# Altium schematic sheet ISC.SchDoc
size A2
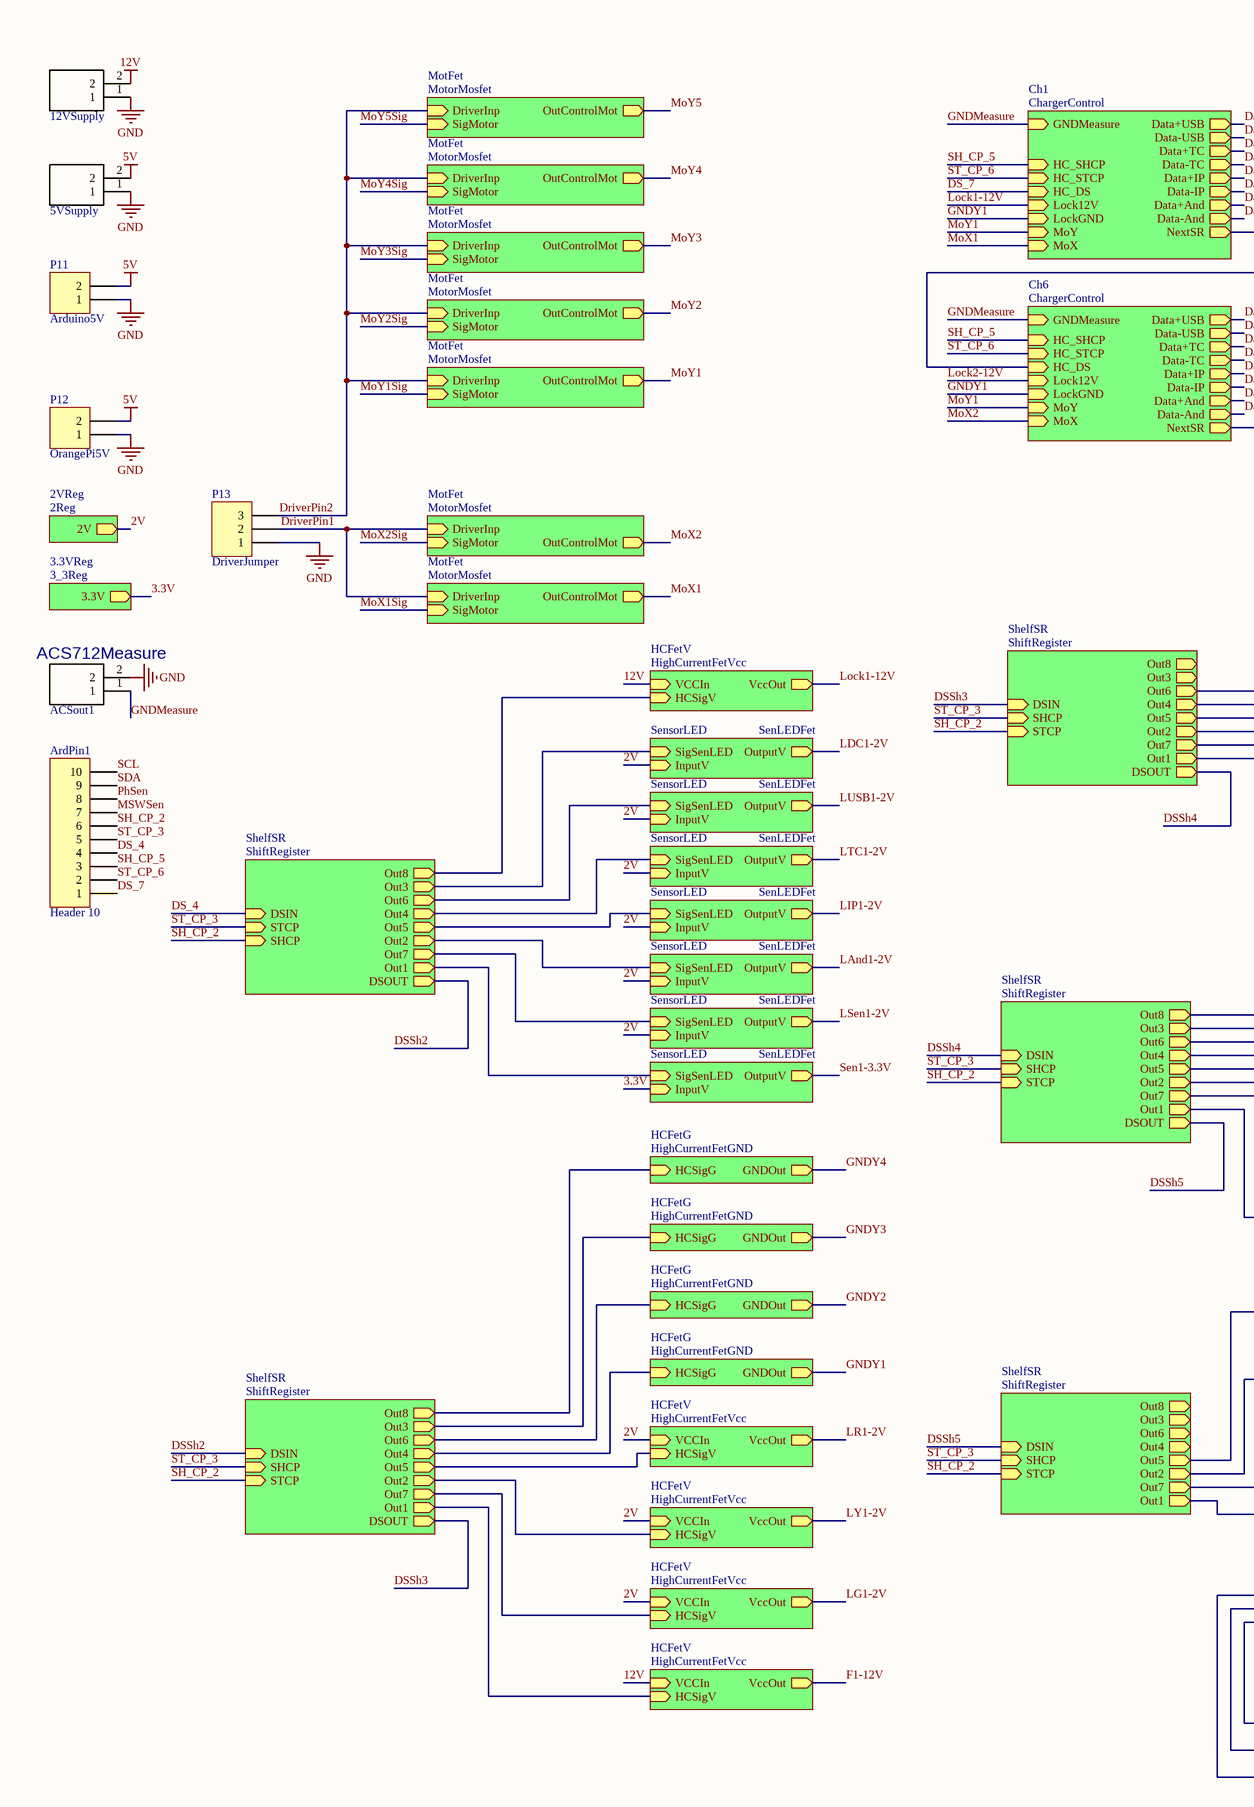
[diagram p0: ISC.SchDoc, left]
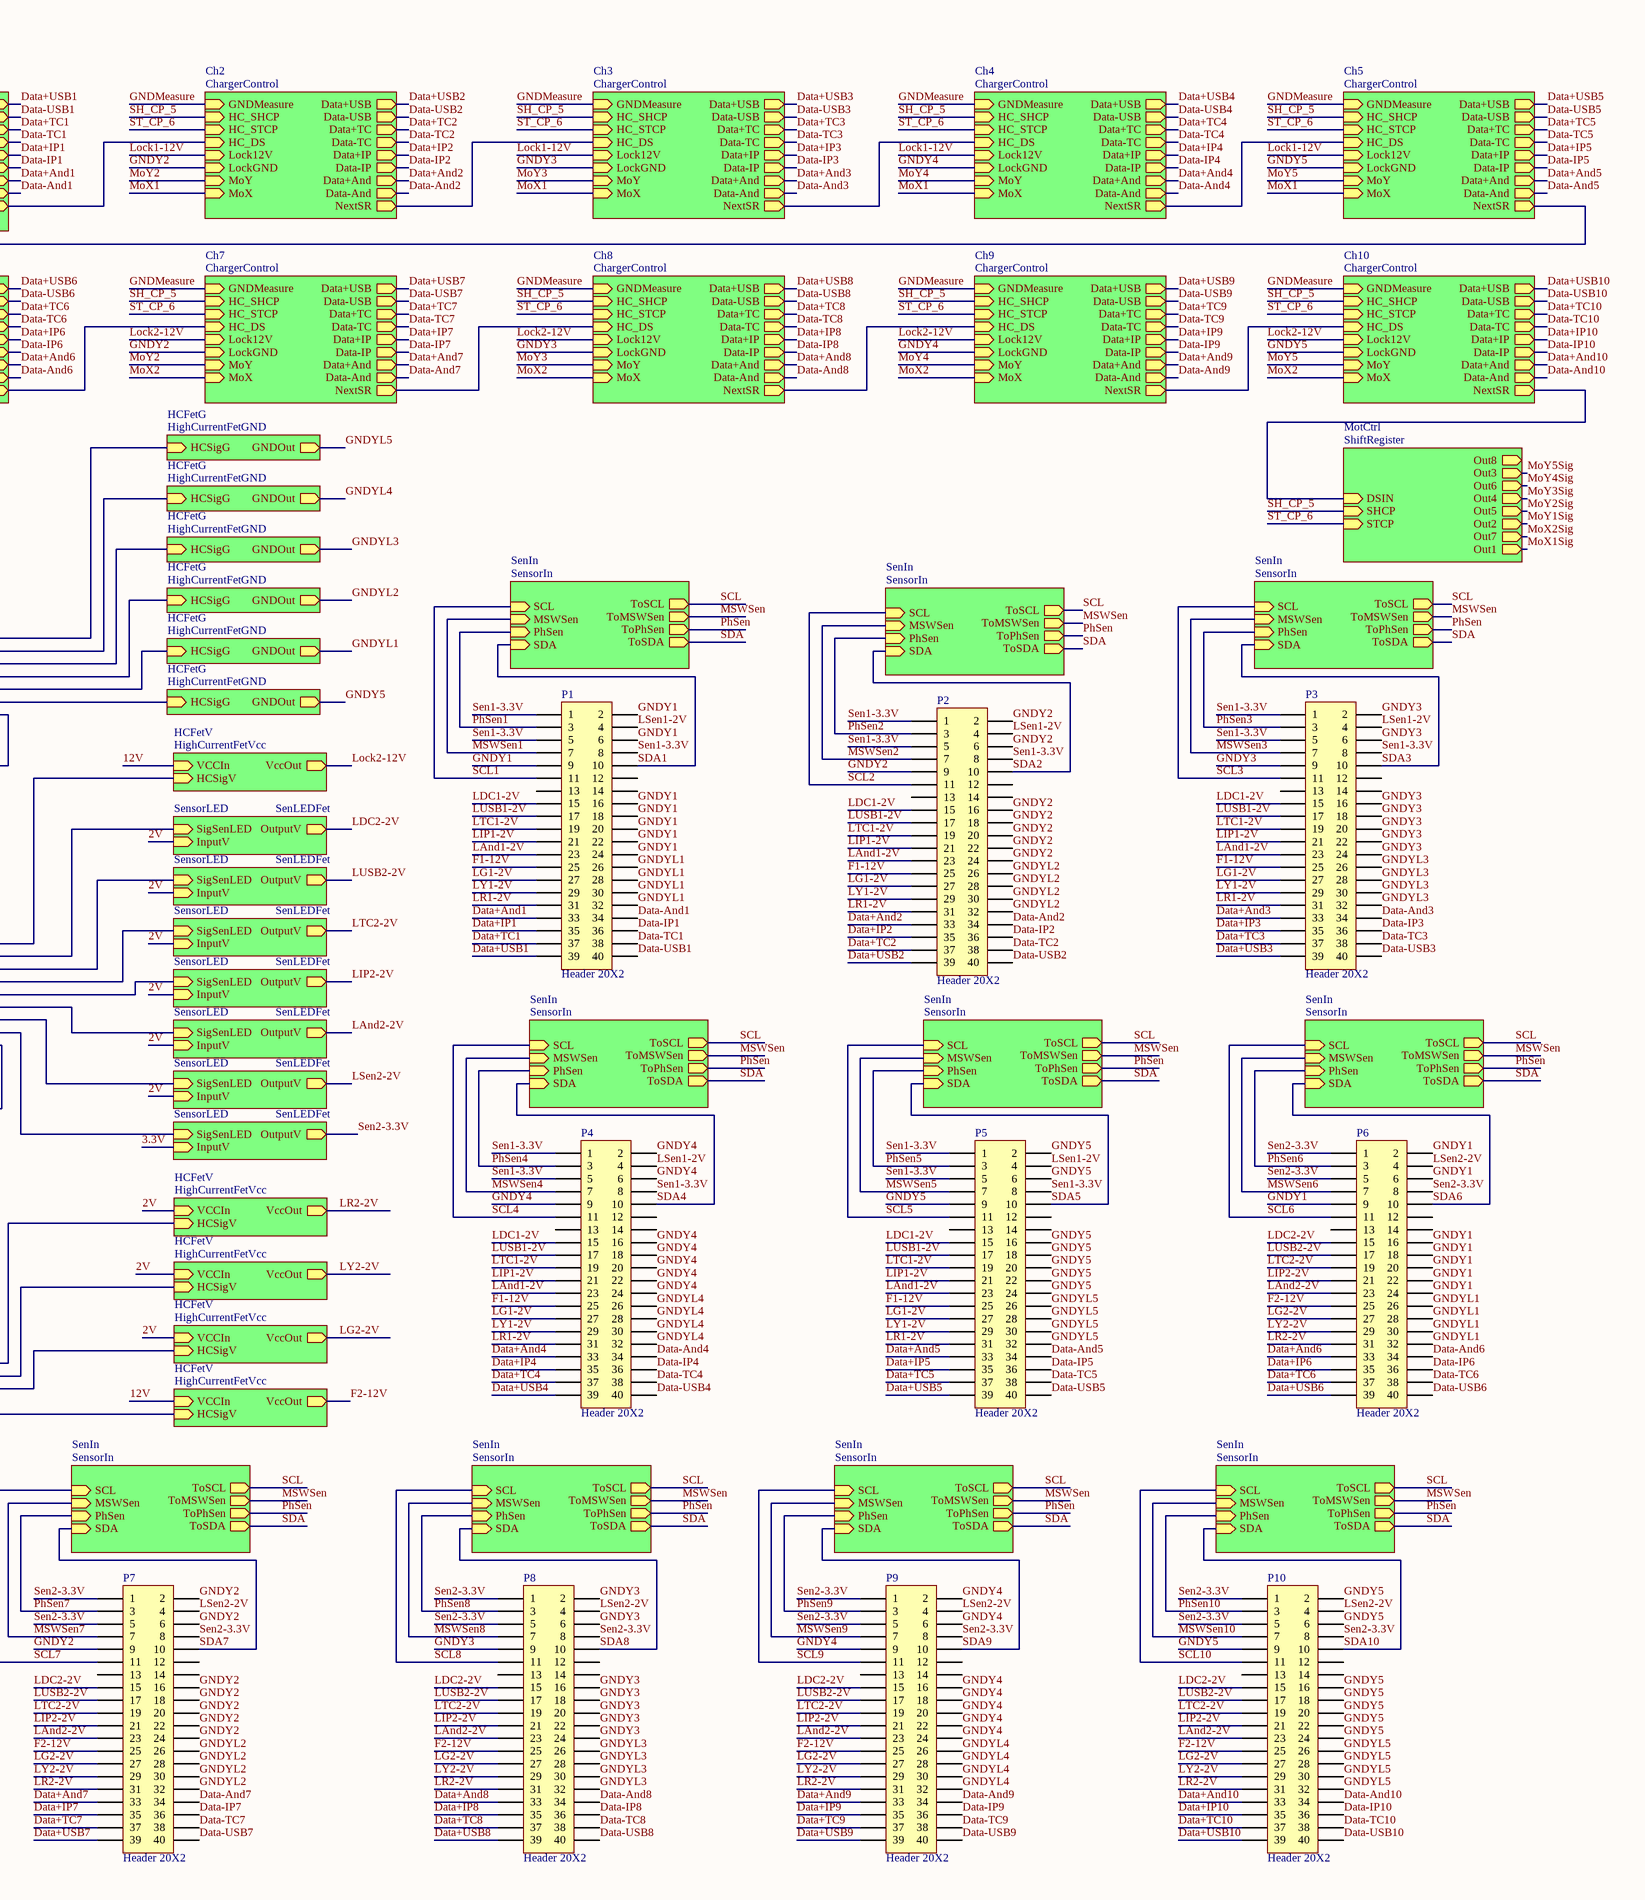
[diagram p1: ISC.SchDoc, right]

## Parts
5VSupply  6-1123723-2  [*TE_6-1123723-2]  (value not drawn)
12VSupply  6-1123723-2  [*TE_6-1123723-2]  (value not drawn)
ACSout1  ACS712Measure  [*TE_6-1123723-2]
ArdPin1  Header 10  [HDR1X10]
P1  Header 20X2  [HDR2X20]
P2  Header 20X2  [HDR2X20]
P3  Header 20X2  [HDR2X20]
P4  Header 20X2  [HDR2X20]
P5  Header 20X2  [HDR2X20]
P6  Header 20X2  [HDR2X20]
P7  Header 20X2  [HDR2X20]
P8  Header 20X2  [HDR2X20]
P9  Header 20X2  [HDR2X20]
P10  Header 20X2  [HDR2X20]
P11  Arduino5V  [HDR1X2]
P12  OrangePi5V  [HDR1X2]
P13  DriverJumper  [HDR1X3]

## Sub-sheets
2VReg = 2Reg: 2V (out)
3.3VReg = 3_3Reg: 3.3V (out)
Ch1 = ChargerControl: GNDMeasure (in), HC_SHCP (in), HC_STCP (in), HC_DS (in), Data+USB (out), Data-USB (out), Data-TC (out), Data+TC (out), Data-And (out), Data+IP (out), Data-IP (out), Data+And (out), NextSR (out), Lock12V (in), LockGND (in), MoY (in), MoX (in)
Ch2 = ChargerControl: GNDMeasure (in), MoY (in), MoX (in), HC_SHCP (in), HC_STCP (in), HC_DS (in), Data+USB (out), Data-USB (out), Data-TC (out), Data+TC (out), Data-And (out), Data+IP (out), Data-IP (out), Data+And (out), NextSR (out), Lock12V (in), LockGND (in)
Ch3 = ChargerControl: GNDMeasure (in), MoY (in), MoX (in), HC_SHCP (in), HC_STCP (in), HC_DS (in), Data+USB (out), Data-USB (out), Data-TC (out), Data+TC (out), Data-And (out), Data+IP (out), Data-IP (out), Data+And (out), NextSR (out), Lock12V (in), LockGND (in)
Ch4 = ChargerControl: GNDMeasure (in), MoY (in), MoX (in), HC_SHCP (in), HC_STCP (in), HC_DS (in), Data+USB (out), Data-USB (out), Data-TC (out), Data+TC (out), Data-And (out), Data+IP (out), Data-IP (out), Data+And (out), NextSR (out), Lock12V (in), LockGND (in)
Ch5 = ChargerControl: GNDMeasure (in), MoY (in), MoX (in), HC_SHCP (in), HC_STCP (in), HC_DS (in), Data+USB (out), Data-USB (out), Data-TC (out), Data+TC (out), Data-And (out), Data+IP (out), Data-IP (out), Data+And (out), NextSR (out), Lock12V (in), LockGND (in)
Ch6 = ChargerControl: GNDMeasure (in), Data+USB (out), Data-USB (out), Data-TC (out), Data+TC (out), Data-And (out), Data+IP (out), Data-IP (out), Data+And (out), NextSR (out), HC_SHCP (in), HC_STCP (in), HC_DS (in), Lock12V (in), LockGND (in), MoY (in), MoX (in)
Ch7 = ChargerControl: GNDMeasure (in), MoY (in), MoX (in), HC_SHCP (in), HC_STCP (in), HC_DS (in), Data+USB (out), Data-USB (out), Data-TC (out), Data+TC (out), Data-And (out), Data+IP (out), Data-IP (out), Data+And (out), NextSR (out), Lock12V (in), LockGND (in)
Ch8 = ChargerControl: GNDMeasure (in), MoY (in), MoX (in), HC_SHCP (in), HC_STCP (in), HC_DS (in), Data+USB (out), Data-USB (out), Data-TC (out), Data+TC (out), Data-And (out), Data+IP (out), Data-IP (out), Data+And (out), NextSR (out), Lock12V (in), LockGND (in)
Ch9 = ChargerControl: GNDMeasure (in), MoY (in), MoX (in), HC_SHCP (in), HC_STCP (in), HC_DS (in), Data+USB (out), Data-USB (out), Data-TC (out), Data+TC (out), Data-And (out), Data+IP (out), Data-IP (out), Data+And (out), NextSR (out), Lock12V (in), LockGND (in)
Ch10 = ChargerControl: GNDMeasure (in), MoY (in), MoX (in), HC_SHCP (in), HC_STCP (in), HC_DS (in), Data+USB (out), Data-USB (out), Data-TC (out), Data+TC (out), Data-And (out), Data+IP (out), Data-IP (out), Data+And (out), NextSR (out), Lock12V (in), LockGND (in)
HCFetG = HighCurrentFetGND: HCSigG (in), GNDOut (out)
HCFetG = HighCurrentFetGND: HCSigG (in), GNDOut (out)
HCFetG = HighCurrentFetGND: HCSigG (in), GNDOut (out)
HCFetG = HighCurrentFetGND: HCSigG (in), GNDOut (out)
HCFetG = HighCurrentFetGND: HCSigG (in), GNDOut (out)
HCFetG = HighCurrentFetGND: HCSigG (in), GNDOut (out)
HCFetG = HighCurrentFetGND: HCSigG (in), GNDOut (out)
HCFetG = HighCurrentFetGND: HCSigG (in), GNDOut (out)
HCFetG = HighCurrentFetGND: HCSigG (in), GNDOut (out)
HCFetG = HighCurrentFetGND: HCSigG (in), GNDOut (out)
HCFetV = HighCurrentFetVcc: HCSigV (in), VCCIn (in), VccOut (out)
HCFetV = HighCurrentFetVcc: HCSigV (in), VCCIn (in), VccOut (out)
HCFetV = HighCurrentFetVcc: HCSigV (in), VCCIn (in), VccOut (out)
HCFetV = HighCurrentFetVcc: HCSigV (in), VCCIn (in), VccOut (out)
HCFetV = HighCurrentFetVcc: HCSigV (in), VCCIn (in), VccOut (out)
HCFetV = HighCurrentFetVcc: HCSigV (in), VCCIn (in), VccOut (out)
HCFetV = HighCurrentFetVcc: HCSigV (in), VCCIn (in), VccOut (out)
HCFetV = HighCurrentFetVcc: HCSigV (in), VCCIn (in), VccOut (out)
HCFetV = HighCurrentFetVcc: HCSigV (in), VCCIn (in), VccOut (out)
HCFetV = HighCurrentFetVcc: HCSigV (in), VCCIn (in), VccOut (out)
MotCtrl = ShiftRegister: DSIN (in), SHCP (in), STCP (in), Out8 (out), Out3 (out), Out6 (out), Out4 (out), Out5 (out), Out2 (out), Out7 (out), Out1 (out)
MotFet = MotorMosfet: DriverInp (in), SigMotor (in), OutControlMot (out)
MotFet = MotorMosfet: DriverInp (in), SigMotor (in), OutControlMot (out)
MotFet = MotorMosfet: DriverInp (in), SigMotor (in), OutControlMot (out)
MotFet = MotorMosfet: DriverInp (in), SigMotor (in), OutControlMot (out)
MotFet = MotorMosfet: DriverInp (in), SigMotor (in), OutControlMot (out)
MotFet = MotorMosfet: DriverInp (in), SigMotor (in), OutControlMot (out)
MotFet = MotorMosfet: DriverInp (in), SigMotor (in), OutControlMot (out)
SenIn = SensorIn: SCL (in), MSWSen (in), PhSen (in), SDA (in), ToSCL (out), ToMSWSen (out), ToPhSen (out), ToSDA (out)
SenIn = SensorIn: SCL (in), MSWSen (in), PhSen (in), SDA (in), ToSCL (out), ToMSWSen (out), ToPhSen (out), ToSDA (out)
SenIn = SensorIn: SCL (in), MSWSen (in), PhSen (in), SDA (in), ToSCL (out), ToMSWSen (out), ToPhSen (out), ToSDA (out)
SenIn = SensorIn: SCL (in), MSWSen (in), PhSen (in), SDA (in), ToSCL (out), ToMSWSen (out), ToPhSen (out), ToSDA (out)
SenIn = SensorIn: SCL (in), MSWSen (in), PhSen (in), SDA (in), ToSCL (out), ToMSWSen (out), ToPhSen (out), ToSDA (out)
SenIn = SensorIn: SCL (in), MSWSen (in), PhSen (in), SDA (in), ToSCL (out), ToMSWSen (out), ToPhSen (out), ToSDA (out)
SenIn = SensorIn: SCL (in), MSWSen (in), PhSen (in), SDA (in), ToSCL (out), ToMSWSen (out), ToPhSen (out), ToSDA (out)
SenIn = SensorIn: SCL (in), MSWSen (in), PhSen (in), SDA (in), ToSCL (out), ToMSWSen (out), ToPhSen (out), ToSDA (out)
SenIn = SensorIn: SCL (in), MSWSen (in), PhSen (in), SDA (in), ToSCL (out), ToMSWSen (out), ToPhSen (out), ToSDA (out)
SenIn = SensorIn: SCL (in), MSWSen (in), PhSen (in), SDA (in), ToSCL (out), ToMSWSen (out), ToPhSen (out), ToSDA (out)
SensorLED = SenLEDFet: SigSenLED (in), OutputV (out), InputV (in)
SensorLED = SenLEDFet: SigSenLED (in), OutputV (out), InputV (in)
SensorLED = SenLEDFet: SigSenLED (in), OutputV (out), InputV (in)
SensorLED = SenLEDFet: SigSenLED (in), OutputV (out), InputV (in)
SensorLED = SenLEDFet: SigSenLED (in), OutputV (out), InputV (in)
SensorLED = SenLEDFet: SigSenLED (in), OutputV (out), InputV (in)
SensorLED = SenLEDFet: SigSenLED (in), OutputV (out), InputV (in)
SensorLED = SenLEDFet: SigSenLED (in), OutputV (out), InputV (in)
SensorLED = SenLEDFet: SigSenLED (in), OutputV (out), InputV (in)
SensorLED = SenLEDFet: SigSenLED (in), OutputV (out), InputV (in)
SensorLED = SenLEDFet: SigSenLED (in), OutputV (out), InputV (in)
SensorLED = SenLEDFet: SigSenLED (in), OutputV (out), InputV (in)
SensorLED = SenLEDFet: SigSenLED (in), OutputV (out), InputV (in)
SensorLED = SenLEDFet: SigSenLED (in), OutputV (out), InputV (in)
ShelfSR = ShiftRegister: DSIN (in), SHCP (in), STCP (in), Out8 (out), Out3 (out), Out6 (out), Out4 (out), Out5 (out), Out2 (out), Out7 (out), Out1 (out), DSOUT (out)
ShelfSR = ShiftRegister: DSIN (in), SHCP (in), STCP (in), Out8 (out), Out3 (out), Out6 (out), Out4 (out), Out5 (out), Out2 (out), Out7 (out), Out1 (out), DSOUT (out)
ShelfSR = ShiftRegister: DSIN (in), SHCP (in), STCP (in), Out8 (out), Out3 (out), Out6 (out), Out4 (out), Out5 (out), Out2 (out), Out7 (out), Out1 (out), DSOUT (out)
ShelfSR = ShiftRegister: DSIN (in), SHCP (in), STCP (in), Out8 (out), Out3 (out), Out6 (out), Out4 (out), Out5 (out), Out2 (out), Out7 (out), Out1 (out), DSOUT (out)
ShelfSR = ShiftRegister: DSIN (in), SHCP (in), STCP (in), Out8 (out), Out3 (out), Out6 (out), Out4 (out), Out5 (out), Out2 (out), Out7 (out), Out1 (out)

## Nets
5V: 5VSupply.2 P11.2 P12.2
12V: 12VSupply.2 ; sheet HCFetV/VCCIn, sheet HCFetV/VCCIn, sheet HCFetV/VCCIn, sheet HCFetV/VCCIn
GND: 5VSupply.1 12VSupply.1 ACSout1.2 P11.1 P12.1 P13.1
2V: sheet 2VReg/2V, sheet SensorLED/InputV, sheet HCFetV/VCCIn, sheet HCFetV/VCCIn, sheet HCFetV/VCCIn, sheet SensorLED/InputV, sheet SensorLED/InputV, sheet SensorLED/InputV, sheet SensorLED/InputV, sheet SensorLED/InputV, sheet SensorLED/InputV, sheet SensorLED/InputV, sheet SensorLED/InputV, sheet SensorLED/InputV, sheet SensorLED/InputV, sheet SensorLED/InputV, sheet HCFetV/VCCIn, sheet HCFetV/VCCIn, sheet HCFetV/VCCIn
3.3V: sheet 3.3VReg/3.3V, sheet SensorLED/InputV, sheet SensorLED/InputV
Data+And1: P1.33 ; sheet Ch1/Data+And
Data+And2: P2.33 ; sheet Ch2/Data+And
Data+And3: P3.33 ; sheet Ch3/Data+And
Data+And4: P4.33 ; sheet Ch4/Data+And
Data+And5: P5.33 ; sheet Ch5/Data+And
Data+And6: P6.33 ; sheet Ch6/Data+And
Data+And7: P7.33 ; sheet Ch7/Data+And
Data+And8: P8.33 ; sheet Ch8/Data+And
Data+And9: P9.33 ; sheet Ch9/Data+And
Data+And10: P10.33 ; sheet Ch10/Data+And
Data+IP1: P1.35 ; sheet Ch1/Data+IP
Data+IP2: P2.35 ; sheet Ch2/Data+IP
Data+IP3: P3.35 ; sheet Ch3/Data+IP
Data+IP4: P4.35 ; sheet Ch4/Data+IP
Data+IP5: P5.35 ; sheet Ch5/Data+IP
Data+IP6: P6.35 ; sheet Ch6/Data+IP
Data+IP7: P7.35 ; sheet Ch7/Data+IP
Data+IP8: P8.35 ; sheet Ch8/Data+IP
Data+IP9: P9.35 ; sheet Ch9/Data+IP
Data+IP10: P10.35 ; sheet Ch10/Data+IP
Data+TC1: P1.37 ; sheet Ch1/Data+TC
Data+TC2: P2.37 ; sheet Ch2/Data+TC
Data+TC3: P3.37 ; sheet Ch3/Data+TC
Data+TC4: P4.37 ; sheet Ch4/Data+TC
Data+TC5: P5.37 ; sheet Ch5/Data+TC
Data+TC6: P6.37 ; sheet Ch6/Data+TC
Data+TC7: P7.37 ; sheet Ch7/Data+TC
Data+TC8: P8.37 ; sheet Ch8/Data+TC
Data+TC9: P9.37 ; sheet Ch9/Data+TC
Data+TC10: P10.37 ; sheet Ch10/Data+TC
Data+USB1: P1.39 ; sheet Ch1/Data+USB
Data+USB2: P2.39 ; sheet Ch2/Data+USB
Data+USB3: P3.39 ; sheet Ch3/Data+USB
Data+USB4: P4.39 ; sheet Ch4/Data+USB
Data+USB5: P5.39 ; sheet Ch5/Data+USB
Data+USB6: P6.39 ; sheet Ch6/Data+USB
Data+USB7: P7.39 ; sheet Ch7/Data+USB
Data+USB8: P8.39 ; sheet Ch8/Data+USB
Data+USB9: P9.39 ; sheet Ch9/Data+USB
Data+USB10: P10.39 ; sheet Ch10/Data+USB
Data-And1: P1.34 ; sheet Ch1/Data-And
Data-And2: P2.34 ; sheet Ch2/Data-And
Data-And3: P3.34 ; sheet Ch3/Data-And
Data-And4: P4.34 ; sheet Ch4/Data-And
Data-And5: P5.34 ; sheet Ch5/Data-And
Data-And6: P6.34 ; sheet Ch6/Data-And
Data-And7: P7.34 ; sheet Ch7/Data-And
Data-And8: P8.34 ; sheet Ch8/Data-And
Data-And9: P9.34 ; sheet Ch9/Data-And
Data-And10: P10.34 ; sheet Ch10/Data-And
Data-IP1: P1.36 ; sheet Ch1/Data-IP
Data-IP2: P2.36 ; sheet Ch2/Data-IP
Data-IP3: P3.36 ; sheet Ch3/Data-IP
Data-IP4: P4.36 ; sheet Ch4/Data-IP
Data-IP5: P5.36 ; sheet Ch5/Data-IP
Data-IP6: P6.36 ; sheet Ch6/Data-IP
Data-IP7: P7.36 ; sheet Ch7/Data-IP
Data-IP8: P8.36 ; sheet Ch8/Data-IP
Data-IP9: P9.36 ; sheet Ch9/Data-IP
Data-IP10: P10.36 ; sheet Ch10/Data-IP
Data-TC1: P1.38 ; sheet Ch1/Data-TC
Data-TC2: P2.38 ; sheet Ch2/Data-TC
Data-TC3: P3.38 ; sheet Ch3/Data-TC
Data-TC4: P4.38 ; sheet Ch4/Data-TC
Data-TC5: P5.38 ; sheet Ch5/Data-TC
Data-TC6: P6.38 ; sheet Ch6/Data-TC
Data-TC7: P7.38 ; sheet Ch7/Data-TC
Data-TC8: P8.38 ; sheet Ch8/Data-TC
Data-TC9: P9.38 ; sheet Ch9/Data-TC
Data-TC10: P10.38 ; sheet Ch10/Data-TC
Data-USB1: P1.40 ; sheet Ch1/Data-USB
Data-USB2: P2.40 ; sheet Ch2/Data-USB
Data-USB3: P3.40 ; sheet Ch3/Data-USB
Data-USB4: P4.40 ; sheet Ch4/Data-USB
Data-USB5: P5.40 ; sheet Ch5/Data-USB
Data-USB6: P6.40 ; sheet Ch6/Data-USB
Data-USB7: P7.40 ; sheet Ch7/Data-USB
Data-USB8: P8.40 ; sheet Ch8/Data-USB
Data-USB9: P9.40 ; sheet Ch9/Data-USB
Data-USB10: P10.40 ; sheet Ch10/Data-USB
DriverPin1: P13.2 ; sheet MotFet/DriverInp, sheet MotFet/DriverInp
DriverPin2: P13.3 ; sheet MotFet/DriverInp, sheet MotFet/DriverInp, sheet MotFet/DriverInp, sheet MotFet/DriverInp, sheet MotFet/DriverInp
DS_4: ArdPin1.4 ; sheet ShelfSR/DSIN
DS_7: ArdPin1.1 ; sheet Ch1/HC_DS
DSSh2: sheet ShelfSR/DSOUT, sheet ShelfSR/DSIN
DSSh3: sheet ShelfSR/DSOUT, sheet ShelfSR/DSIN
DSSh4: sheet ShelfSR/DSOUT, sheet ShelfSR/DSIN
DSSh5: sheet ShelfSR/DSOUT, sheet ShelfSR/DSIN
F1-12V: P1.25 P2.25 P3.25 P4.25 P5.25 ; sheet HCFetV/VccOut
F2-12V: P6.25 P7.25 P8.25 P9.25 P10.25 ; sheet HCFetV/VccOut
GNDMeasure: ACSout1.1 ; sheet Ch1/GNDMeasure, sheet Ch2/GNDMeasure, sheet Ch3/GNDMeasure, sheet Ch4/GNDMeasure, sheet Ch5/GNDMeasure, sheet Ch6/GNDMeasure, sheet Ch7/GNDMeasure, sheet Ch8/GNDMeasure, sheet Ch9/GNDMeasure, sheet Ch10/GNDMeasure
GNDY1: P1.2 P1.6 P1.9 P1.16 P1.18 P1.20 P1.22 P1.24 P6.2 P6.6 P6.9 P6.16 P6.18 P6.20 P6.22 P6.24 ; sheet Ch1/LockGND, sheet HCFetG/GNDOut, sheet Ch6/LockGND
GNDY2: P2.2 P2.6 P2.9 P2.16 P2.18 P2.20 P2.22 P2.24 P7.2 P7.6 P7.9 P7.16 P7.18 P7.20 P7.22 P7.24 ; sheet HCFetG/GNDOut, sheet Ch2/LockGND, sheet Ch7/LockGND
GNDY3: P3.2 P3.6 P3.9 P3.16 P3.18 P3.20 P3.22 P3.24 P8.2 P8.6 P8.9 P8.16 P8.18 P8.20 P8.22 P8.24 ; sheet HCFetG/GNDOut, sheet Ch3/LockGND, sheet Ch8/LockGND
GNDY4: P4.2 P4.6 P4.9 P4.16 P4.18 P4.20 P4.22 P4.24 P9.2 P9.6 P9.9 P9.16 P9.18 P9.20 P9.22 P9.24 ; sheet HCFetG/GNDOut, sheet Ch4/LockGND, sheet Ch9/LockGND
GNDY5: P5.2 P5.6 P5.9 P5.16 P5.18 P5.20 P5.22 P5.24 P10.2 P10.6 P10.9 P10.16 P10.18 P10.20 P10.22 P10.24 ; sheet HCFetG/GNDOut, sheet Ch5/LockGND, sheet Ch10/LockGND
GNDYL1: P1.26 P1.28 P1.30 P1.32 P6.26 P6.28 P6.30 P6.32 ; sheet HCFetG/GNDOut
GNDYL2: P2.26 P2.28 P2.30 P2.32 P7.26 P7.28 P7.30 P7.32 ; sheet HCFetG/GNDOut
GNDYL3: P3.26 P3.28 P3.30 P3.32 P8.26 P8.28 P8.30 P8.32 ; sheet HCFetG/GNDOut
GNDYL4: P4.26 P4.28 P4.30 P4.32 P9.26 P9.28 P9.30 P9.32 ; sheet HCFetG/GNDOut
GNDYL5: P5.26 P5.28 P5.30 P5.32 P10.26 P10.28 P10.30 P10.32 ; sheet HCFetG/GNDOut
LAnd1-2V: P1.23 P2.23 P3.23 P4.23 P5.23 ; sheet SensorLED/OutputV
LAnd2-2V: P6.23 P7.23 P8.23 P9.23 P10.23 ; sheet SensorLED/OutputV
LDC1-2V: P1.15 P2.15 P3.15 P4.15 P5.15 ; sheet SensorLED/OutputV
LDC2-2V: P6.15 P7.15 P8.15 P9.15 P10.15 ; sheet SensorLED/OutputV
LG1-2V: P1.27 P2.27 P3.27 P4.27 P5.27 ; sheet HCFetV/VccOut
LG2-2V: P6.27 P7.27 P8.27 P9.27 P10.27 ; sheet HCFetV/VccOut
LIP1-2V: P1.21 P2.21 P3.21 P4.21 P5.21 ; sheet SensorLED/OutputV
LIP2-2V: P6.21 P7.21 P8.21 P9.21 P10.21 ; sheet SensorLED/OutputV
Lock1-12V: sheet Ch1/Lock12V, sheet HCFetV/VccOut, sheet Ch2/Lock12V, sheet Ch3/Lock12V, sheet Ch4/Lock12V, sheet Ch5/Lock12V
Lock2-12V: sheet HCFetV/VccOut, sheet Ch6/Lock12V, sheet Ch7/Lock12V, sheet Ch8/Lock12V, sheet Ch9/Lock12V, sheet Ch10/Lock12V
LR1-2V: P1.31 P2.31 P3.31 P4.31 P5.31 ; sheet HCFetV/VccOut
LR2-2V: P6.31 P7.31 P8.31 P9.31 P10.31 ; sheet HCFetV/VccOut
LSen1-2V: P1.4 P2.4 P3.4 P4.4 P5.4 ; sheet SensorLED/OutputV
LSen2-2V: P6.4 P7.4 P8.4 P9.4 P10.4 ; sheet SensorLED/OutputV
LTC1-2V: P1.19 P2.19 P3.19 P4.19 P5.19 ; sheet SensorLED/OutputV
LTC2-2V: P6.19 P7.19 P8.19 P9.19 P10.19 ; sheet SensorLED/OutputV
LUSB1-2V: P1.17 P2.17 P3.17 P4.17 P5.17 ; sheet SensorLED/OutputV
LUSB2-2V: P6.17 P7.17 P8.17 P9.17 P10.17 ; sheet SensorLED/OutputV
LY1-2V: P1.29 P2.29 P3.29 P4.29 P5.29 ; sheet HCFetV/VccOut
LY2-2V: P6.29 P7.29 P8.29 P9.29 P10.29 ; sheet HCFetV/VccOut
MoX1: sheet Ch1/MoX, sheet MotFet/OutControlMot, sheet Ch2/MoX, sheet Ch3/MoX, sheet Ch4/MoX, sheet Ch5/MoX
MoX1Sig: sheet MotFet/SigMotor, sheet MotCtrl/Out1
MoX2: sheet MotFet/OutControlMot, sheet Ch6/MoX, sheet Ch7/MoX, sheet Ch8/MoX, sheet Ch9/MoX, sheet Ch10/MoX
MoX2Sig: sheet MotFet/SigMotor, sheet MotCtrl/Out7
MoY1: sheet Ch1/MoY, sheet MotFet/OutControlMot, sheet Ch6/MoY
MoY1Sig: sheet MotFet/SigMotor, sheet MotCtrl/Out2
MoY2: sheet MotFet/OutControlMot, sheet Ch2/MoY, sheet Ch7/MoY
MoY2Sig: sheet MotFet/SigMotor, sheet MotCtrl/Out5
MoY3: sheet MotFet/OutControlMot, sheet Ch3/MoY, sheet Ch8/MoY
MoY3Sig: sheet MotFet/SigMotor, sheet MotCtrl/Out4
MoY4: sheet MotFet/OutControlMot, sheet Ch4/MoY, sheet Ch9/MoY
MoY4Sig: sheet MotFet/SigMotor, sheet MotCtrl/Out6
MoY5: sheet MotFet/OutControlMot, sheet Ch5/MoY, sheet Ch10/MoY
MoY5Sig: sheet MotFet/SigMotor, sheet MotCtrl/Out3
MSWSen: ArdPin1.7 ; sheet SenIn/ToMSWSen, sheet SenIn/ToMSWSen, sheet SenIn/ToMSWSen, sheet SenIn/ToMSWSen, sheet SenIn/ToMSWSen, sheet SenIn/ToMSWSen, sheet SenIn/ToMSWSen, sheet SenIn/ToMSWSen, sheet SenIn/ToMSWSen, sheet SenIn/ToMSWSen
MSWSen1: P1.7 ; sheet SenIn/MSWSen
MSWSen2: P2.7 ; sheet SenIn/MSWSen
MSWSen3: P3.7 ; sheet SenIn/MSWSen
MSWSen4: P4.7 ; sheet SenIn/MSWSen
MSWSen5: P5.7 ; sheet SenIn/MSWSen
MSWSen6: P6.7 ; sheet SenIn/MSWSen
MSWSen7: P7.7 ; sheet SenIn/MSWSen
MSWSen8: P8.7 ; sheet SenIn/MSWSen
MSWSen9: P9.7 ; sheet SenIn/MSWSen
MSWSen10: P10.7 ; sheet SenIn/MSWSen
PhSen: ArdPin1.8 ; sheet SenIn/ToPhSen, sheet SenIn/ToPhSen, sheet SenIn/ToPhSen, sheet SenIn/ToPhSen, sheet SenIn/ToPhSen, sheet SenIn/ToPhSen, sheet SenIn/ToPhSen, sheet SenIn/ToPhSen, sheet SenIn/ToPhSen, sheet SenIn/ToPhSen
PhSen1: P1.3 ; sheet SenIn/PhSen
PhSen2: P2.3 ; sheet SenIn/PhSen
PhSen3: P3.3 ; sheet SenIn/PhSen
PhSen4: P4.3 ; sheet SenIn/PhSen
PhSen5: P5.3 ; sheet SenIn/PhSen
PhSen6: P6.3 ; sheet SenIn/PhSen
PhSen7: P7.3 ; sheet SenIn/PhSen
PhSen8: P8.3 ; sheet SenIn/PhSen
PhSen9: P9.3 ; sheet SenIn/PhSen
PhSen10: P10.3 ; sheet SenIn/PhSen
SCL: ArdPin1.10 ; sheet SenIn/ToSCL, sheet SenIn/ToSCL, sheet SenIn/ToSCL, sheet SenIn/ToSCL, sheet SenIn/ToSCL, sheet SenIn/ToSCL, sheet SenIn/ToSCL, sheet SenIn/ToSCL, sheet SenIn/ToSCL, sheet SenIn/ToSCL
SCL1: P1.11 ; sheet SenIn/SCL
SCL2: P2.11 ; sheet SenIn/SCL
SCL3: P3.11 ; sheet SenIn/SCL
SCL4: P4.11 ; sheet SenIn/SCL
SCL5: P5.11 ; sheet SenIn/SCL
SCL6: P6.11 ; sheet SenIn/SCL
SCL7: P7.11 ; sheet SenIn/SCL
SCL8: P8.11 ; sheet SenIn/SCL
SCL9: P9.11 ; sheet SenIn/SCL
SCL10: P10.11 ; sheet SenIn/SCL
SDA: ArdPin1.9 ; sheet SenIn/ToSDA, sheet SenIn/ToSDA, sheet SenIn/ToSDA, sheet SenIn/ToSDA, sheet SenIn/ToSDA, sheet SenIn/ToSDA, sheet SenIn/ToSDA, sheet SenIn/ToSDA, sheet SenIn/ToSDA, sheet SenIn/ToSDA
SDA1: P1.10 ; sheet SenIn/SDA
SDA2: P2.10 ; sheet SenIn/SDA
SDA3: P3.10 ; sheet SenIn/SDA
SDA4: P4.10 ; sheet SenIn/SDA
SDA5: P5.10 ; sheet SenIn/SDA
SDA6: P6.10 ; sheet SenIn/SDA
SDA7: P7.10 ; sheet SenIn/SDA
SDA8: P8.10 ; sheet SenIn/SDA
SDA9: P9.10 ; sheet SenIn/SDA
SDA10: P10.10 ; sheet SenIn/SDA
Sen1-3.3V: P1.1 P1.5 P1.8 P2.1 P2.5 P2.8 P3.1 P3.5 P3.8 P4.1 P4.5 P4.8 P5.1 P5.5 P5.8 ; sheet SensorLED/OutputV
Sen2-3.3V: P6.1 P6.5 P6.8 P7.1 P7.5 P7.8 P8.1 P8.5 P8.8 P9.1 P9.5 P9.8 P10.1 P10.5 P10.8 ; sheet SensorLED/OutputV
SH_CP_2: ArdPin1.6 ; sheet ShelfSR/SHCP, sheet ShelfSR/STCP, sheet ShelfSR/STCP, sheet ShelfSR/STCP, sheet ShelfSR/STCP
SH_CP_5: ArdPin1.3 ; sheet Ch1/HC_SHCP, sheet MotCtrl/SHCP, sheet Ch2/HC_SHCP, sheet Ch3/HC_SHCP, sheet Ch4/HC_SHCP, sheet Ch5/HC_SHCP, sheet Ch6/HC_SHCP, sheet Ch7/HC_SHCP, sheet Ch8/HC_SHCP, sheet Ch9/HC_SHCP, sheet Ch10/HC_SHCP
ST_CP_3: ArdPin1.5 ; sheet ShelfSR/STCP, sheet ShelfSR/SHCP, sheet ShelfSR/SHCP, sheet ShelfSR/SHCP, sheet ShelfSR/SHCP
ST_CP_6: ArdPin1.2 ; sheet Ch1/HC_STCP, sheet MotCtrl/STCP, sheet Ch2/HC_STCP, sheet Ch3/HC_STCP, sheet Ch4/HC_STCP, sheet Ch5/HC_STCP, sheet Ch6/HC_STCP, sheet Ch7/HC_STCP, sheet Ch8/HC_STCP, sheet Ch9/HC_STCP, sheet Ch10/HC_STCP
(unnamed): sheet Ch1/NextSR, sheet Ch2/HC_DS
(unnamed): sheet HCFetV/HCSigV, sheet ShelfSR/Out8
(unnamed): sheet MotCtrl/DSIN, sheet Ch10/NextSR
(unnamed): sheet ShelfSR/Out3, sheet SensorLED/SigSenLED
(unnamed): sheet ShelfSR/Out6, sheet SensorLED/SigSenLED
(unnamed): sheet ShelfSR/Out4, sheet SensorLED/SigSenLED
(unnamed): sheet ShelfSR/Out5, sheet SensorLED/SigSenLED
(unnamed): sheet ShelfSR/Out2, sheet SensorLED/SigSenLED
(unnamed): sheet ShelfSR/Out7, sheet SensorLED/SigSenLED
(unnamed): sheet ShelfSR/Out1, sheet SensorLED/SigSenLED
(unnamed): sheet ShelfSR/Out8, sheet HCFetG/HCSigG
(unnamed): sheet ShelfSR/Out3, sheet HCFetG/HCSigG
(unnamed): sheet ShelfSR/Out6, sheet HCFetG/HCSigG
(unnamed): sheet ShelfSR/Out4, sheet HCFetG/HCSigG
(unnamed): sheet ShelfSR/Out5, sheet HCFetV/HCSigV
(unnamed): sheet ShelfSR/Out2, sheet HCFetV/HCSigV
(unnamed): sheet ShelfSR/Out7, sheet HCFetV/HCSigV
(unnamed): sheet ShelfSR/Out1, sheet HCFetV/HCSigV
(unnamed): sheet ShelfSR/Out6, sheet HCFetG/HCSigG
(unnamed): sheet ShelfSR/Out4, sheet HCFetG/HCSigG
(unnamed): sheet ShelfSR/Out5, sheet HCFetG/HCSigG
(unnamed): sheet ShelfSR/Out2, sheet HCFetG/HCSigG
(unnamed): sheet ShelfSR/Out7, sheet HCFetG/HCSigG
(unnamed): sheet ShelfSR/Out1, sheet HCFetG/HCSigG
(unnamed): sheet ShelfSR/Out8, sheet HCFetV/HCSigV
(unnamed): sheet ShelfSR/Out3, sheet SensorLED/SigSenLED
(unnamed): sheet ShelfSR/Out6, sheet SensorLED/SigSenLED
(unnamed): sheet ShelfSR/Out4, sheet SensorLED/SigSenLED
(unnamed): sheet ShelfSR/Out5, sheet SensorLED/SigSenLED
(unnamed): sheet ShelfSR/Out2, sheet SensorLED/SigSenLED
(unnamed): sheet ShelfSR/Out7, sheet SensorLED/SigSenLED
(unnamed): sheet ShelfSR/Out1, sheet SensorLED/SigSenLED
(unnamed): sheet ShelfSR/Out5, sheet HCFetV/HCSigV
(unnamed): sheet ShelfSR/Out2, sheet HCFetV/HCSigV
(unnamed): sheet ShelfSR/Out7, sheet HCFetV/HCSigV
(unnamed): sheet ShelfSR/Out1, sheet HCFetV/HCSigV
(unnamed): sheet Ch2/NextSR, sheet Ch3/HC_DS
(unnamed): sheet Ch3/NextSR, sheet Ch4/HC_DS
(unnamed): sheet Ch4/NextSR, sheet Ch5/HC_DS
(unnamed): sheet Ch5/NextSR, sheet Ch6/HC_DS
(unnamed): sheet Ch6/NextSR, sheet Ch7/HC_DS
(unnamed): sheet Ch7/NextSR, sheet Ch8/HC_DS
(unnamed): sheet Ch8/NextSR, sheet Ch9/HC_DS
(unnamed): sheet Ch9/NextSR, sheet Ch10/HC_DS

Not connected (* = marked no-connect by the designer): P1 12 13 14; P2 12 13 14; P3 12 13 14; P4 12 13 14; P5 12 13 14; P6 12 13 14; P7 12 13 14; P8 12 13 14; P9 12 13 14; P10 12 13 14

## Notes on the sheet
- Title
- Size:
- Date:
- File:
- A2
- Number:
- Time:
- Revision:
- Sheet
- of

## Library data of the parts
5VSupply 12VSupply ACSout1 = 6-1123723-2: 3.96 EP HDR ASSY 2P_GREEN_; MF: TE Connectivity; Number_of_Positions: 2; Product_Type: Header; Centerline_Pitch: 3.96 mm[.156 in]; TE_purchase_URL: https://www.te.com/usa-en/product-6-1123723-2.html?te_bu=Cor&te_type=disp&te_campaign=seda_glo_cor-seda-global-disp-prtnr-fy19-seda-model-bom-cta_sma-317_1&elqCampaignId=32493; MP: 6-1123723-2; Price: None; Availability: Unavailable; Package: None; EU_RoHS_Compliance: Compliant; SnapEDA_Link: https://www.snapeda.com/parts/6-1123723-2/TE%20Connectivity%20AMP%20Connectors/view-part/?ref=snap; Value: *
ArdPin1 = Header 10: Header, 10-Pin; LatestRevisionDate: 17-Jul-2002; LatestRevisionNote: Re-released for DXP Platform.; Publisher: Altium Limited
P1-P10 = Header 20X2: Header, 20-Pin, Dual row; LatestRevisionDate: 17-Jul-2002; LatestRevisionNote: Re-released for DXP Platform.; Publisher: Altium Limited
P11 P12 = Header 2: Header, 2-Pin; LatestRevisionDate: 17-Jul-2002; LatestRevisionNote: Re-released for DXP Platform.; Publisher: Altium Limited
P13 = Header 3: Header, 3-Pin; LatestRevisionDate: 17-Jul-2002; LatestRevisionNote: Re-released for DXP Platform.; Publisher: Altium Limited